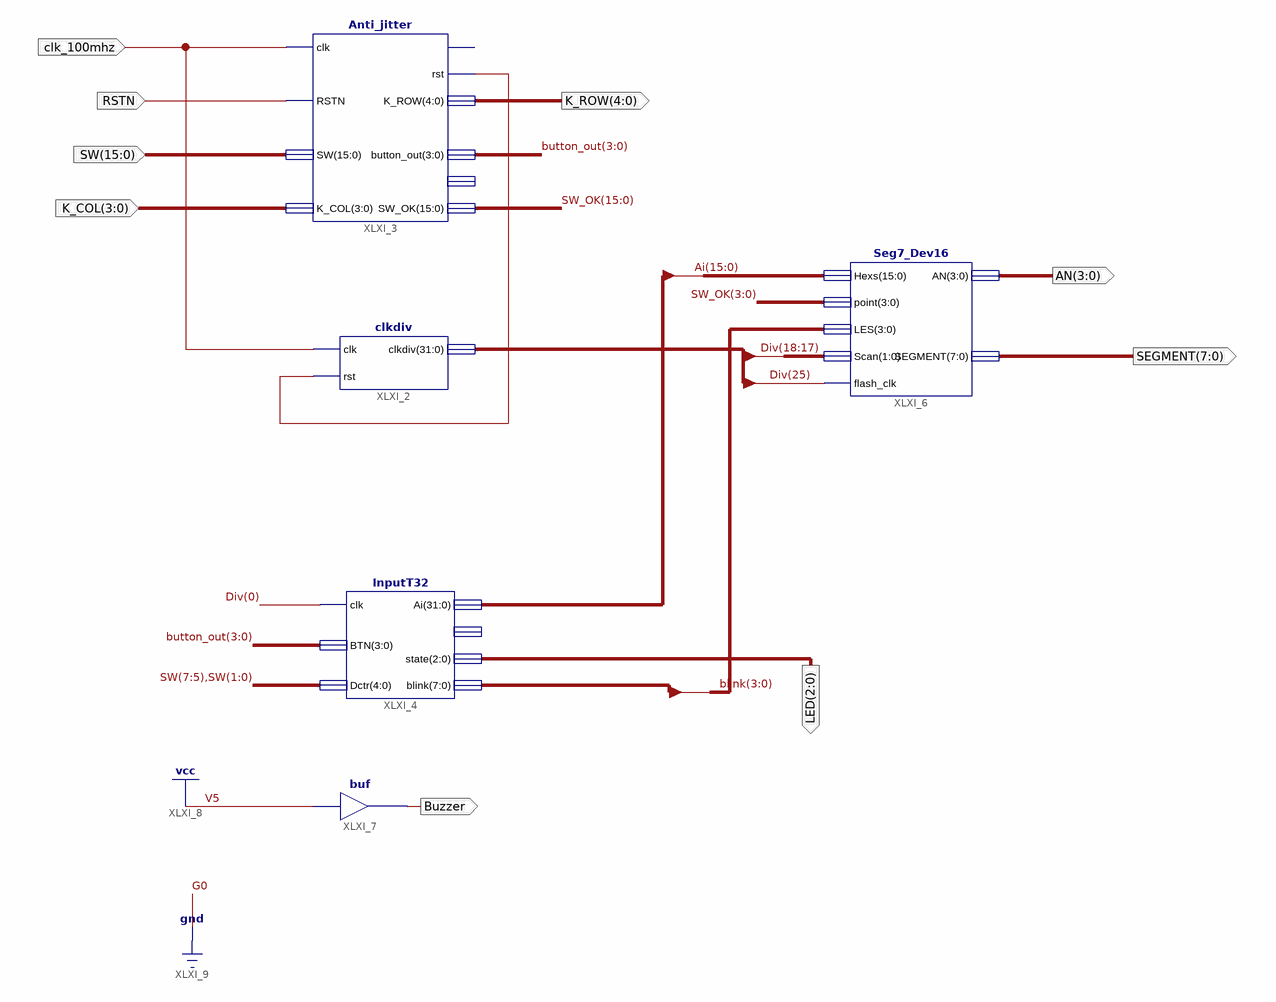
[diagram p0: schematic sheet 1]
// Xilinx ISE schematic I2Disp.sch (kintex7) as structural Verilog: 5 symbols, 9 ports
module I2Disp (
  input  clk_100mhz,
  input  RSTN,
  input  [15:0] SW,
  input  [3:0] K_COL,
  output [4:0] K_ROW,
  output [2:0] LED,
  output Buzzer,
  output [3:0] AN,
  output [7:0] SEGMENT
);

  wire XLXN_1;
  wire [3:0] button_out;
  wire [7:0] blink;
  wire [15:0] SW_OK;
  wire [31:0] Ai, Div;

  clkdiv XLXI_2 (.clk(clk_100mhz), .rst(XLXN_1), .clkdiv(Div));
  Anti_jitter XLXI_3 (
    .clk(clk_100mhz), .RSTN(RSTN), .SW(SW), .K_COL(K_COL), .rst(XLXN_1), .K_ROW(K_ROW),
    .button_out(button_out), .SW_OK(SW_OK));  // open: CR, button_pulse
  InputT32 XLXI_4 (
    .clk(Div[0]), .BTN(button_out), .Dctr({SW[7:5], SW[1:0]}), .Ai(Ai), .state(LED), .blink(blink));  // open: Bi
  Seg7_Dev16 XLXI_6 (
    .Hexs(Ai[15:0]), .point(SW_OK[3:0]), .LES(blink[3:0]), .Scan(Div[18:17]), .flash_clk(Div[25]), .AN(AN),
    .SEGMENT(SEGMENT));
  buf XLXI_7 (Buzzer, 1'b1);
endmodule
